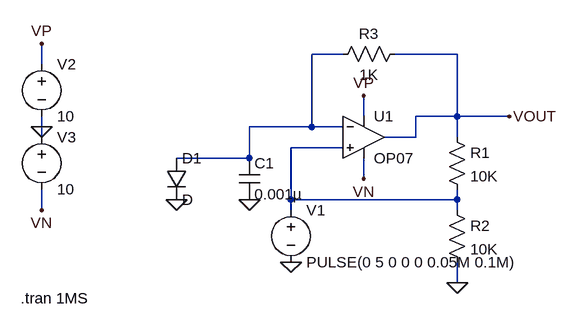
[diagram p0: schematic MONOSTABLE_MULTIVIBRATOR.asc]
MONOSTABLE_MULTIVIBRATOR.asc, the LTspice schematic file:
Version 4
SHEET 1 880 680
WIRE 176 0 128 0
WIRE 352 0 256 0
WIRE -288 16 -288 -16
WIRE 208 96 208 64
WIRE 352 96 352 0
WIRE 352 96 288 96
WIRE 432 96 352 96
WIRE -288 112 -288 96
WIRE 128 112 128 0
WIRE 128 112 32 112
WIRE 176 112 128 112
WIRE -288 128 -288 112
WIRE 288 128 288 96
WIRE 288 128 240 128
WIRE 352 128 352 96
WIRE 176 144 96 144
WIRE 32 160 32 112
WIRE 32 160 -80 160
WIRE 208 192 208 160
WIRE 96 224 96 144
WIRE 352 224 352 208
WIRE 352 224 96 224
WIRE -288 240 -288 208
WIRE 96 240 96 224
WIRE 352 240 352 224
WIRE 352 352 352 320
FLAG 96 320 0
FLAG 32 224 0
FLAG -288 112 0
FLAG -80 224 0
FLAG 352 352 0
FLAG 208 64 VP
FLAG -288 -16 VP
FLAG -288 240 VN
FLAG 208 192 VN
FLAG 432 96 VOUT
SYMBOL OpAmps\\OP07 208 64 R0
SYMATTR InstName U1
SYMBOL voltage 96 224 R0
WINDOW 123 0 0 Left 0
WINDOW 39 0 0 Left 0
SYMATTR InstName V1
SYMATTR Value PULSE(0 5 0 0 0 0.05M 0.1M)
SYMBOL voltage -288 0 R0
WINDOW 123 0 0 Left 0
WINDOW 39 0 0 Left 0
SYMATTR InstName V2
SYMATTR Value 10
SYMBOL voltage -288 112 R0
WINDOW 123 0 0 Left 0
WINDOW 39 0 0 Left 0
SYMATTR InstName V3
SYMATTR Value 10
SYMBOL cap 16 160 R0
SYMATTR InstName C1
SYMATTR Value 0.001µ
SYMBOL diode -96 160 R0
SYMATTR InstName D1
SYMBOL res 336 112 R0
SYMATTR InstName R1
SYMATTR Value 10K
SYMBOL res 336 224 R0
SYMATTR InstName R2
SYMATTR Value 10K
SYMBOL res 272 -16 R90
WINDOW 0 0 56 VBottom 2
WINDOW 3 32 56 VTop 2
SYMATTR InstName R3
SYMATTR Value 1K
TEXT -320 376 Left 2 !.tran 1MS

The netlist it stands for:
* MONOSTABLE_MULTIVIBRATOR.asc
XU1 N002 N001 VP VN VOUT LT1001  ; OP07, pins In+ In- V+ V- OUT
V1 N002 0 PULSE(0 5 0 0 0 0.05M 0.1M)
V2 VP 0 10
V3 0 VN 10
C1 N001 0 0.001µ
D1 N001 0 D
R1 VOUT N002 10K
R2 N002 0 10K
R3 VOUT N001 1K
.model D D
.lib standard.dio
.tran 1MS
.lib LTC.lib
.backanno
.end